# Altium schematic sheet Heartrate_Monitor_External.SchDoc: Heart Rate Monitor External
size A4; DocumentNumber: 10; SheetNumber: 10; SheetTotal: 31
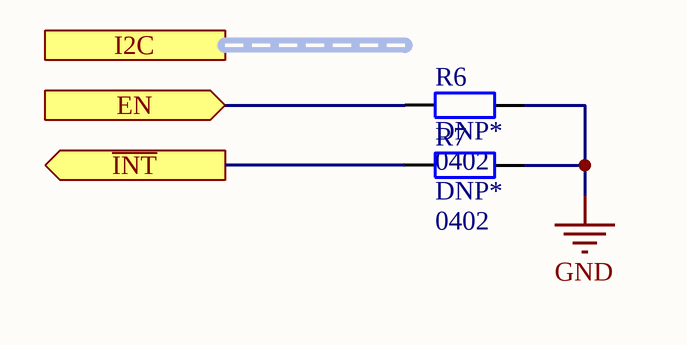
[diagram p0: Heartrate_Monitor_External.SchDoc]

## Parts
R6  DNP*  Case/Package: 0402  [0402R]  (no BOM)
R7  DNP*  Case/Package: 0402  [0402R]  (no BOM)

## Ports
EN (in), I2C (harness I2C), ~{INT} (out)

## Nets
GND: R6.1 R7.1
~{INT}: R7.2 ; port ~{INT}
EN: R6.2 ; port EN

## Notes on the sheet
- Title
- Size:
- Date:
- A4
- Number:
- Time:
- Revision:
- Sheet
- of
- File:

## Library data of the parts
R6 R7 = RES SMD NO BOM 0402: Placeholder for a 0402 resistor